# Altium schematic sheet oscillograph.SchDoc
size A4; Organization: Altium Limited; Address1: L3, 12a Rodborough Rd; Address2: Frenchs Forest; Address3: NSW; Address4: Australia 2086
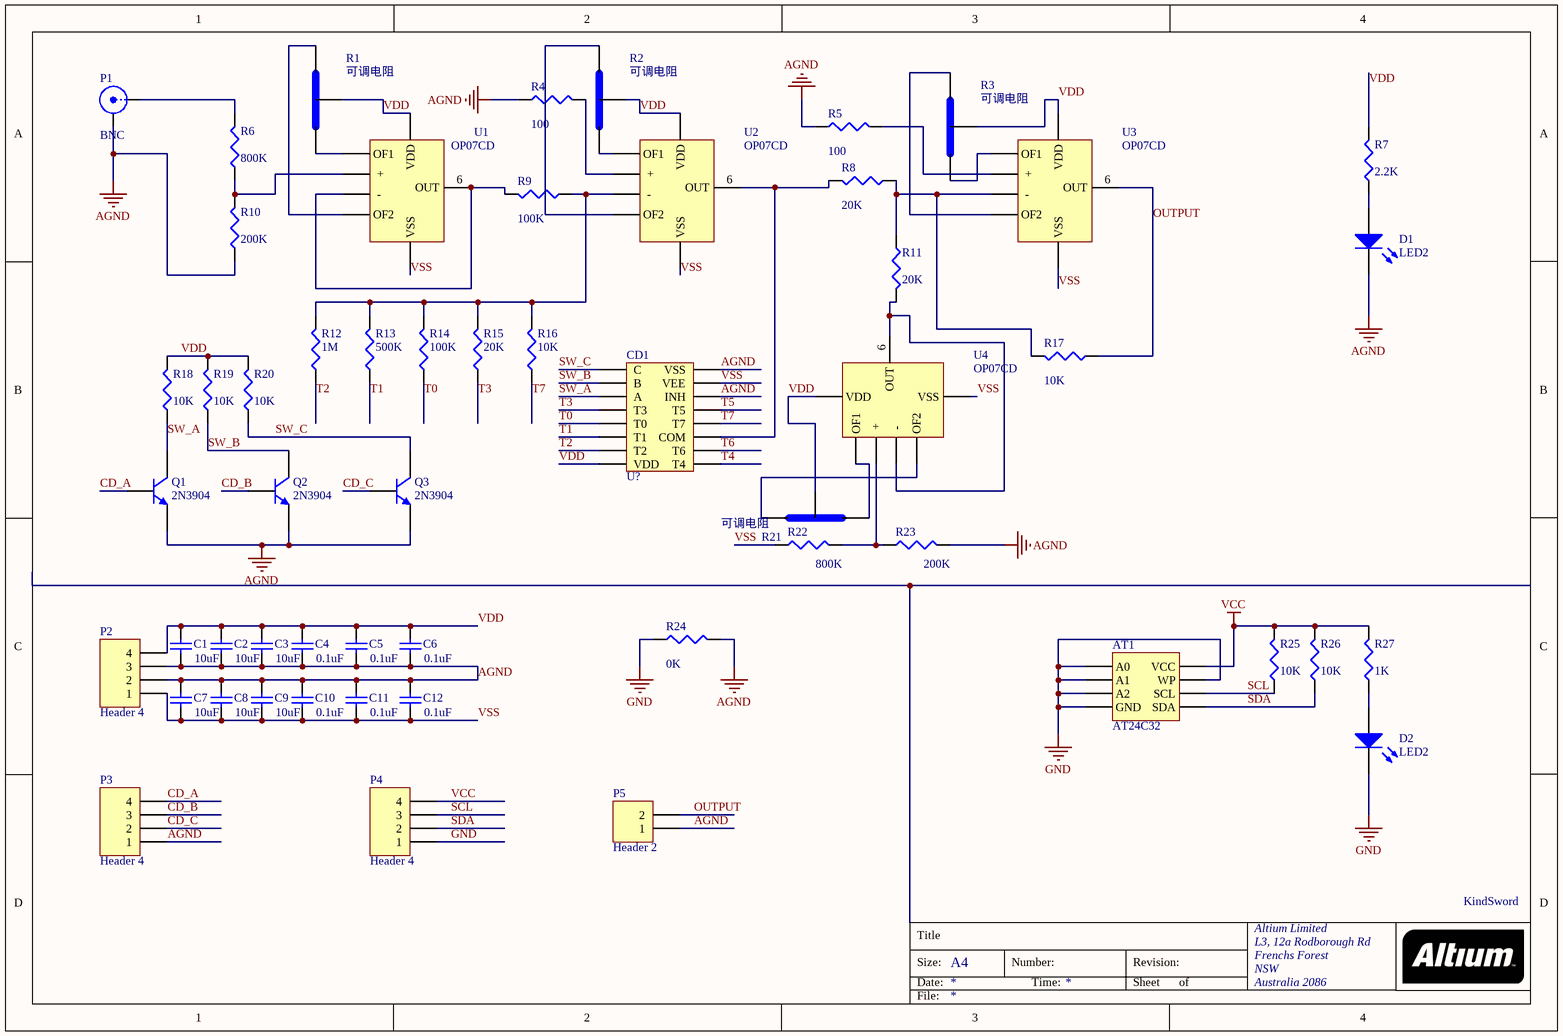
[diagram p0: oscillograph.SchDoc]

## Parts
AT1  AT24C32  [AT24]
C1  value 10uF  [1608[0603]]  (hidden comment: Cap Semi)
C2  value 10uF  [1608[0603]]  (hidden comment: Cap Semi)
C3  value 10uF  [1608[0603]]  (hidden comment: Cap Semi)
C4  value 0.1uF  [1608[0603]]  (hidden comment: Cap Semi)
C5  value 0.1uF  [1608[0603]]  (hidden comment: Cap Semi)
C6  value 0.1uF  [1608[0603]]  (hidden comment: Cap Semi)
C7  value 10uF  [1608[0603]]  (hidden comment: Cap Semi)
C8  value 10uF  [1608[0603]]  (hidden comment: Cap Semi)
C9  value 10uF  [1608[0603]]  (hidden comment: Cap Semi)
C10  value 0.1uF  [1608[0603]]  (hidden comment: Cap Semi)
C11  value 0.1uF  [1608[0603]]  (hidden comment: Cap Semi)
C12  value 0.1uF  [1608[0603]]  (hidden comment: Cap Semi)
CD1  U?  [cd4051]
D1  LED2  [3.2X1.6X1.1]
D2  LED2  [3.2X1.6X1.1]
Logo1  (no value)  [logo]
P1  BNC  [BNC_RA CON]
P2  Header 4  [HDR1X4]
P3  Header 4  [HDR1X4]
P4  Header 4  [HDR1X4]
P5  Header 2  [HDR1X2]
Q1  2N3904  [TO-92A]
Q2  2N3904  [TO-92A]
Q3  2N3904  [TO-92A]
R1  可调电阻  [3296可调电阻]
R2  可调电阻  [3296可调电阻]
R3  可调电阻  [3296可调电阻]
R4  value 100  [J1-0603]  (hidden comment: Res3)
R5  value 100  [J1-0603]  (hidden comment: Res3)
R6  value 800K  [J1-0603]  (hidden comment: Res3)
R7  value 2.2K  [J1-0603]  (hidden comment: Res3)
R8  value 20K  [J1-0603]  (hidden comment: Res3)
R9  value 100K  [J1-0603]  (hidden comment: Res3)
R10  value 200K  [J1-0603]  (hidden comment: Res3)
R11  value 20K  [J1-0603]  (hidden comment: Res3)
R12  value 1M  [J1-0603]  (hidden comment: Res3)
R13  value 500K  [J1-0603]  (hidden comment: Res3)
R14  value 100K  [J1-0603]  (hidden comment: Res3)
R15  value 20K  [J1-0603]  (hidden comment: Res3)
R16  value 10K  [J1-0603]  (hidden comment: Res3)
R17  value 10K  [J1-0603]  (hidden comment: Res3)
R18  value 10K  [J1-0603]  (hidden comment: Res3)
R19  value 10K  [J1-0603]  (hidden comment: Res3)
R20  value 10K  [J1-0603]  (hidden comment: Res3)
R21  可调电阻  [3296可调电阻]
R22  value 800K  [J1-0603]  (hidden comment: Res3)
R23  value 200K  [J1-0603]  (hidden comment: Res3)
R24  value 0K  [J1-0603]  (hidden comment: Res3)
R25  value 10K  [J1-0603]  (hidden comment: Res3)
R26  value 10K  [J1-0603]  (hidden comment: Res3)
R27  value 1K  [J1-0603]  (hidden comment: Res3)
U1  OP07CD  [OP07C]
U2  OP07CD  [OP07C]
U3  OP07CD  [OP07C]
U4  OP07CD  [OP07C]

## Nets
AGND: C1.1 C2.1 C3.1 C4.1 C5.1 C6.1 C7.2 C8.2 C9.2 C10.2 C11.2 C12.2 CD1.6(INH) CD1.8(VSS) D1.2(K) P1.2(Y) P2.2 P2.3 P3.1 P5.1 Q1.1(E) Q2.1(E) Q3.1(E) R4.1 R5.1 R10.1 R23.2 R24.2
GND: AT1.1(A0) AT1.2(A1) AT1.3(A2) AT1.4(GND) AT1.7(WP) D2.2(K) P4.1 R24.1
VCC: AT1.8(VCC) P4.4 R25.2 R26.2 R27.2
CD_A: P3.4 Q1.2(B)
CD_B: P3.3 Q2.2(B)
CD_C: P3.2 Q3.2(B)
OUTPUT: P5.2 R17.1 U3.6(OUT)
SCL: AT1.6(SCL) P4.3 R25.1
SDA: AT1.5(SDA) P4.2 R26.1
SW_A: CD1.11(A) Q1.3(C) R18.1
SW_B: CD1.10(B) Q2.3(C) R19.1
SW_C: CD1.9(C) Q3.3(C) R20.1
T0: CD1.13(T0) R14.1
T1: CD1.14(T1) R13.1
T2: CD1.15(T2) R12.1
T3: CD1.12(T3) R15.1
T4: CD1.1(T4)
T5: CD1.5(T5)
T6: CD1.2(T6)
T7: CD1.4(T7) R16.1
VDD: C1.2 C2.2 C3.2 C4.2 C5.2 C6.2 CD1.16(VDD) P2.4 R1.1 R2.1 R3.1 R7.2 R18.2 R19.2 R20.2 R21.1 U1.7(VDD) U2.7(VDD) U3.7(VDD) U4.7(VDD)
VSS: C7.1 C8.1 C9.1 C10.1 C11.1 C12.1 CD1.7(VEE) P2.1 R22.1 U1.4(VSS) U2.4(VSS) U3.4(VSS) U4.4(VSS)
NetCD1_3: CD1.3(COM) R8.2 U2.6(OUT)
NetD1_1: D1.1(A) R7.1
NetD2_1: D2.1(A) R27.1
NetP1_1: P1.1(X) R6.2
NetR1_0: R1.0 U1.8(OF2)
NetR1_2: R1.2 U1.1(OF1)
NetR2_0: R2.0 U2.8(OF2)
NetR2_2: R2.2 U2.1(OF1)
NetR3_0: R3.0 U3.8(OF2)
NetR3_2: R3.2 U3.1(OF1)
NetR4_2: R4.2 U2.3(+)
NetR5_2: R5.2 U3.3(+)
NetR6_1: R6.1 R10.2 U1.3(+)
NetR8_1: R8.1 R11.1 R17.2 U3.2(-)
NetR9_1: R9.1 R12.2 R13.2 R14.2 R15.2 R16.2 U2.2(-)
NetR9_2: R9.2 U1.2(-) U1.6(OUT)
NetR11_2: R11.2 U4.2(-) U4.6(OUT)
NetR21_0: R21.0 U4.8(OF2)
NetR21_2: R21.2 U4.1(OF1)
NetR22_2: R22.2 R23.1 U4.3(+)

## Notes on the sheet
- Title
- Size:
- Date:
- A4
- Number:
- Time:
- Revision:
- Sheet
- of
- File:
- (in symbol logo) KindSword

## Library data of the parts
C1-C12 = Cap Semi: Capacitor (Semiconductor SIM Model); Published: 8-Jun-2000; LatestRevisionDate: 29-May-2009; LatestRevisionNote: IPC-7351 Footprint Added.; PackageReference: C1206; Publisher: Altium Limited; PackageDescription: Chip Capacitor
CD1 = CD4051B: CD4051
D1 D2 = LED2: Typical RED, GREEN, YELLOW, AMBER GaAs LED; Published: 8-Jun-2000; LatestRevisionDate: 17-Jul-2002; LatestRevisionNote: Re-released for DXP Platform.; PackageVersion: Feb-2002; PackageReference: 3.2X1.6X1.1; Publisher: Altium Limited; PackageDescription: SM LED; 2 Flat Leads
Logo1 = logo: L?
P1 = BNC: BNC Elbow Connector; LatestRevisionDate: 17-Jul-2002; LatestRevisionNote: Re-released for DXP Platform.; Publisher: Altium Limited
P2-P4 = Header 4: Header, 4-Pin; LatestRevisionDate: 17-Jul-2002; LatestRevisionNote: Re-released for DXP Platform.; Publisher: Altium Limited
P5 = Header 2: Header, 2-Pin; LatestRevisionDate: 17-Jul-2002; LatestRevisionNote: Re-released for DXP Platform.; Publisher: Altium Limited
Q1-Q3 = 2N3904: NPN General Purpose Amplifier; Published: 8-Jun-2000; LatestRevisionDate: 15-Jan-2003; LatestRevisionNote: PCB Footprint 'BCY-W3/D4.7' replaced; DatasheetVersion: 1997; PackageVersion: Sep-1998; PackageReference: TO-92A; Publisher: Altium Limited; PackageDescription: TO, Flat Index; 3 In-Line, Axial Leads; Body Dia. 4.5mm; Leads 0.51 x 0.48 mm (max); ComponentLink1Description: Manufacturer Link; ComponentLink1URL: http://www.fairchildsemi.com/; ComponentLink2Description: Datasheet; ComponentLink2URL: http://www.fairchildsemi.com/ds/2N%2F2N3904.pdf
R1-R3 R21 = 3296可调电阻: R?
R4-R20 R22-R27 = Res3: Resistor; Published: 8-Jun-2000; LatestRevisionDate: 29-May-2009; LatestRevisionNote: IPC-7351 Footprint Added.; PackageReference: J1-0603; Publisher: Altium Limited; PackageDescription: Chip Resistor